# EAGLE design 1_3_OLED_FOR_1U (EAGLE 9.2.0)
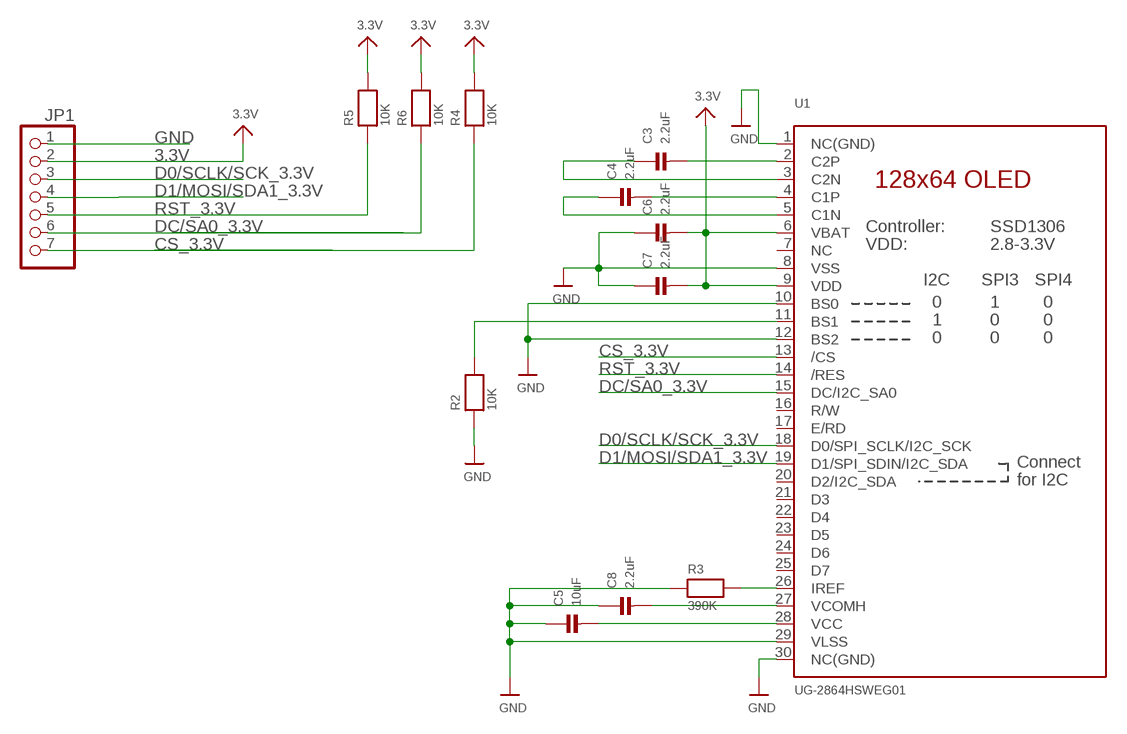
[diagram p0: schematic, sheet 1]

## Parts
C3  2.2uF  CAP_CERAMIC0603MINI  [0603-MINI]
C4  2.2uF  CAP_CERAMIC0603MINI  [0603-MINI]
C5  10uF  CAP_CERAMIC0603MINI  [0603-MINI]
C6  2.2uF  CAP_CERAMIC0603MINI  [0603-MINI]
C7  2.2uF  CAP_CERAMIC0603MINI  [0603-MINI]
C8  2.2uF  CAP_CERAMIC0603MINI  [0603-MINI]
JP1  HEADER-1X7ROUND  [1X07_ROUND]
R2  10K  RESISTOR0603MINI  [0603-MINI]
R3  390K  RESISTOR0603MINI  [0603-MINI]
R4  10K  RESISTOR0603MINI  [0603-MINI]
R5  10K  RESISTOR0603MINI  [0603-MINI]
R6  10K  RESISTOR0603MINI  [0603-MINI]
U1  UG-2864HSWEG01  DISP_OLED_UG-2864HSWEG01  [UG-2864HSWEG01_1.3_WRAPAROUND]

## Nets
3.3V: C6.2 C7.2 JP1.2 R4.2 R5.2 R6.2 U1.6(VBAT) U1.9(VDD)
CS_3.3V: JP1.7 R4.1 U1.13(/CS)
D0/SCLK/SCK_3.3V: JP1.3 U1.18(D0/SPI_SCLK/I2C_SCK)
D1/MOSI/SDA1_3.3V: JP1.4 U1.19(D1/SPI_SDIN/I2C_SDA)
DC/SA0_3.3V: JP1.6 R6.1 U1.15(DC/I2C_SA0)
GND: C5.1 C6.1 C7.1 C8.1 JP1.1 R2.1 R3.1 U1.1(NC(GND)) U1.8(VSS) U1.10(BS0) U1.12(BS2) U1.29(VLSS) U1.30(NC(GND))
N$1: R2.2 U1.11(BS1)
N$3: R3.2 U1.26(IREF)
N$4: C3.2 U1.2(C2P)
N$5: C3.1 U1.3(C2N)
N$6: C4.2 U1.4(C1P)
N$7: C4.1 U1.5(C1N)
N$11: C5.2 U1.28(VCC)
N$12: C8.2 U1.27(VCOMH)
RST_3.3V: JP1.5 R5.1 U1.14(/RES)
Unconnected: U1.7(NC) U1.16(R/W) U1.17(E/RD) U1.20(D2/I2C_SDA) U1.21(D3) U1.22(D4) U1.23(D5) U1.24(D6) U1.25(D7)

## Library data of the parts
C3-C8 = microbuilder:CAP_CERAMIC: Ceramic Capacitors 0402 - 0402 Surface Mount Capacitors 16pF 50V 5% [Digikey: 445-4899-2-ND] 18pF 50V 5% [Digikey: 490-1281-2-ND] 22pF 50V 5% [Digikey: 490-1283-2-ND] 68pF 50V 5% [Digikey: 490-1289-2-ND] 0.1uF 10V 10% [Digikey: 490-1318-2-ND] 1.0uF 6.3V 10% [Digikey: 490-1320-2-ND] 0603 - 0603 Surface Mount Capacitors 16 pF 50V 5% [Digikey: 445-5051-2-ND] 22 pF 50V [Digikey: PCC220ACVTR-ND] 33 pF 50V 5% [Digikey: 490-1415-1-ND] 56pF 50V 5% [Digikey: 490-1421-1-ND] 220pF 50V 5% [Digikey: 445-1285-1-ND] 680 pF 50V 2200 pF 50V 5% C0G [Digikey: 445-1297-1-ND] 5600 pF 100V 5% X7R [Digikey: 478-3711-1-ND] 0.1 µF 25V 10% [Digikey: PCC2277TR-ND] 0.22 µF 16V 10% X7R [Digikey: 445-1318-1-ND] 1.0 µF 25V 10% [Digikey: 445-5146-2-ND] 0603 - RF Specific 3pF 250V +/-0.1pF RF [Digikey: 712-1347-1-ND] 18 pF 250V 5% [Digikey: 478-3505-1-ND or 712-1322-1-ND] 56 pF 250V 5% C0G RF [Digikey: 490-4867-1-ND] 68 pF 250V RF [Digikey: 490-4868-1-ND] 0805 - 0805 Surface Mount Capacitors 220 pF 250V 2% RF Ceramic Capacitor [Digikey: 712-1398-1-ND] 1000 pF 50V 2% NP0 Ceramic Capacitor [Digikey: 478-3760-1-ND] 0.1 µF 25V 10% Ceramic Capacitor [Digikey: PCC1828TR-ND] 1.0 µF 16V 10% Ceramic Capacitor[Digikey: 490-1691-2-ND] 10.0 µF 10V 10% Ceramic Capacitor[Digikey: 709-1228-1-ND] 10.0 uF 16V 10% Ceramic Capacitor [Digikey: 478-5165-2-ND] 47 uF 6.3V 20% Ceramic Capacitor [Digikey: 587-1779-1-ND or 399-5506-1-ND] 1206 - 1206 Surface Mount Capacitors 47uF 10V 20% Ceramic Capacitor [Digikey: 490-5528-1-ND or 399-5508-1-ND or 445-6010-1-ND] 100uF 6.3V -20%, +80% Y5V Ceramic Capacitor (Digikey: 490-4512-1-ND, Mouser: 81-GRM31CF50J107ZE1L)
JP1 = microbuilder:HEADER-1X7: PIN HEADER; SPICEPREFIX: X
R2-R6 = microbuilder:RESISTOR: Resistors 0402 - 0402 Surface Mount Package 22 Ohm 1% 1/16W [Digikey: 311-22.0LRTR-ND] 33 Ohm 5% 1/16W 1.0K 5% 1/16W 1.5K 5% 1/16W 2.0K 1% 1/16W 10.0K 1% 1/16W [Digikey: 311-10.0KLRTR-ND] 10.0K 5% 1/16W [Digikey: RMCF0402JT10K0TR-ND] 12.1K 1% 1/16W [Digikey: 311-22.0LRTR-ND] 100.0K 5% 1/16W 0603 - 0603 Surface Mount Package 0 Ohm 1/10 Watt 1% Resistor 15 Ohm 1/10 Watt 1% Resistor 33 Ohm 1/10 Watt 1% Resistor 49.9 Ohm 1/10 Watt 1% Resistor 100 Ohm 1/10 Watt 1% Resistor 150 Ohm 1/10 Watt 1% Resistor 240 Ohm 1/10 Watt 1% Resistor 390 Ohm 1/10 Watt 1% Resistor 560 Ohm 1/10 Watt 1% Resistor 680 Ohm 1/10 Watt 1% Resistor 750 Ohm 1/10 Watt 1% Resistor 1.0K Ohm 1/10 Watt 1% Resistor 1.5K Ohm 1/10 Watt 1% Resistor 2.0K Ohm 1/10 Watt 1% Resistor 2.2K Ohm 1/10 Watt 1% Resistor 3.3K Ohm 1/10 Watt 1% Resistor 4.7K Ohm 1/10 Watt 1% Resistor 10.0K Ohm 1/10 Watt 1% Resistor 12.0K Ohm 1/10 Watt 1% Resistor 12.1K Ohm 1/10 Watt 1% Resistor 20.0K Ohm 1/10 Watt 1% Resistor 33.0K Ohm 1/10 Watt 1% Resistor 100.0K Ohm 1/10 Watt 1% Resistor 0805 - 0805 Surface Mount Package 0 Ohm 1/8 Watt 1% Resistor 33 Ohm 1/8 Watt 1% Resistor 100 Ohm 1/8 Watt 1% Resistor 150 Ohm 1/8 Watt 1% Resistor 200 Ohm 1/8 Watt 1% Resistor 240 Ohm 1/8 Watt 1% Resistor 330 Ohm 1/8 Watt 1% Resistor 390 Ohm 1/8 Watt 1% Resistor 470 Ohm 1/8 Watt 1% Resistor 1.0K Ohm 1/8 Watt 1% Resistor 1.5K Ohm 1/8 Watt 1% Resistor 2.0K Ohm 1/8 Watt 1% Resistor 4.7K Ohm 1/8 Watt 1% Resistor 5.1K Ohm 1/8 Watt 1% Resistor 5.6K Ohm 1/8 Watt 1% Resistor 10.0K Ohm 1/8 Watt 1% Resistor 22.0K Ohm 1/8 Watt 1% Resistor 33.0K Ohm 1/8 Watt 1% Resistor 100K Ohm 1/8 Watt 1% Resistor 1206 - 1206 Surface Mount Package 2012 - 2010 Surface Mount Package 0.11 Ohm 1/2 Watt 1% Resistor - Digikey: RHM.11UCT-ND
U1 = microbuilder:DISP_OLED_UG-2864HSWEG01: UG-2864HSWEG01 OLED display Both 1.3" and 0.96" models share the same FPC tab footprint, only the screen dimensions vary.

## Board
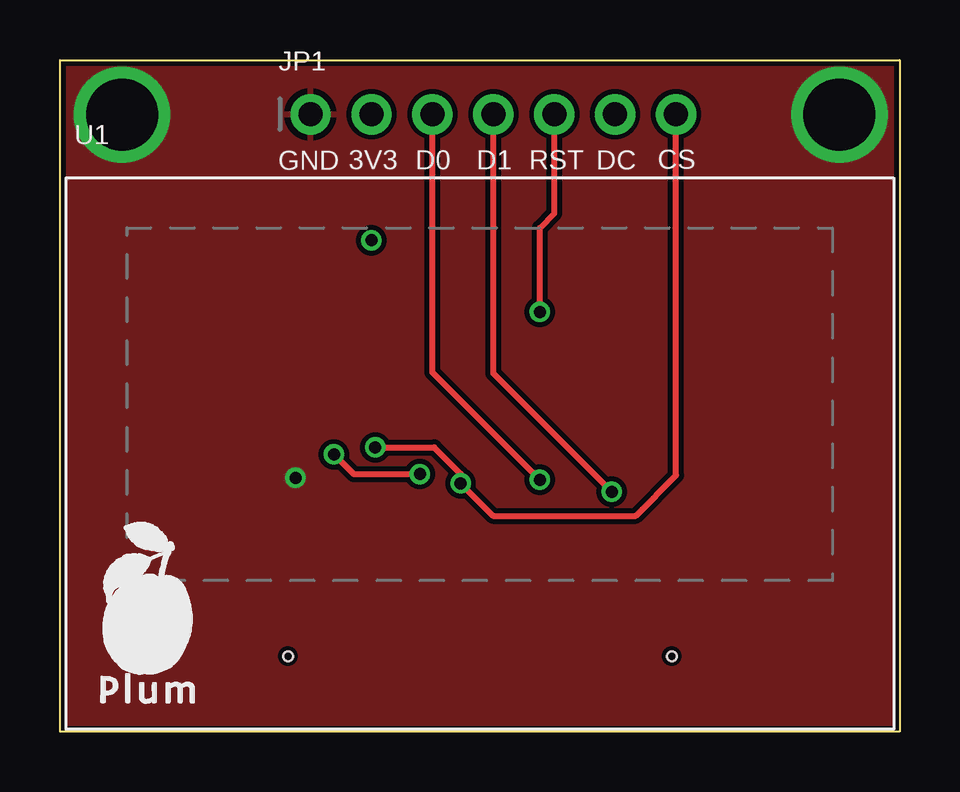
[diagram p1: board, top side]
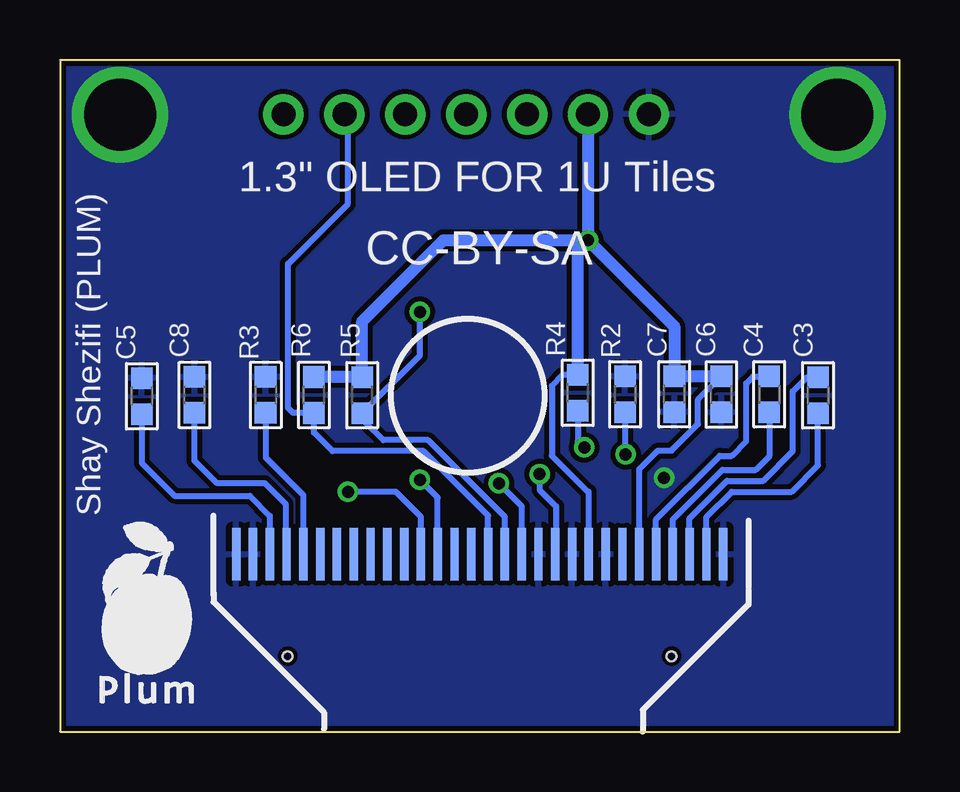
[diagram p2: board, bottom side, seen from below]

Size 35 x 28 mm. Coordinates in mm from the lower left corner, seen from the top.
Outline: 0,0 0,28 35,28 35,0 0,0
Copper layers (1*16): Top 0.0356mm / dielectric 1.5011mm / Bottom 0.0356mm
Design rules "LaenPCBOrder *": minimum track width 6mil, minimum drill 13mil, track to track 8mil, track to pad 8mil, pad to pad 8mil, via to via 8mil, smd to smd 8mil, copper to edge 8mil, drill to drill 8mil, minimum pad ring 7mil, minimum via ring 7mil, stop-mask expansion 3mil, vias tented up to drill 20mil, thermal gap 10mil

### Footprints (pad centres in the part's own frame; a part is rotated, then mirrored left to right if it is on the bottom)
0603-MINI = smd 0.9 x 0.9: 1 -0.75,0; 2 0.75,0
1X07_ROUND = drill 1 pad 1.676: 1 -7.62,0; 2 -5.08,0; 3 -2.54,0; 4 0,0; 5 2.54,0; 6 5.08,0; 7 7.62,0
UG-2864HSWEG01_1.3_WRAPAROUND = smd 0.35 x 2.2 bottom: 1 -10.15,-0.2; 2 -9.45,-0.2; 3 -8.75,-0.2; 4 -8.05,-0.2; 5 -7.35,-0.2; 6 -6.65,-0.2; 7 -5.95,-0.2; 8 -5.25,-0.2; 9 -4.55,-0.2; 10 -3.85,-0.2; 11 -3.15,-0.2; 12 -2.45,-0.2; 13 -1.75,-0.2; 14 -1.05,-0.2; 15 -0.35,-0.2; 16 0.35,-0.2; 17 1.05,-0.2; 18 1.75,-0.2; 19 2.45,-0.2; 20 3.15,-0.2; 21 3.85,-0.2; 22 4.55,-0.2; 23 5.25,-0.2; 24 5.95,-0.2; 25 6.65,-0.2; 26 7.35,-0.2; 27 8.05,-0.2; 28 8.75,-0.2; 29 9.45,-0.2; 30 10.15,-0.2 | hole 0.4: -8,-4.45; 8,-4.45

### Placement (x,y rotation side)
C3  3.4,14.02 270 bottom
C4  5.43,14.06 270 bottom
C5  31.59,13.98 270 bottom
C6  7.43,14.06 90 bottom
C7  9.39,14.07 90 bottom
C8  29.4,14.04 270 bottom
JP1  18.07,25.73 0 top
R2  11.44,14.06 270 bottom
R3  26.43,14.04 270 bottom
R4  13.41,14.12 90 bottom
R5  22.4,14.03 90 bottom
R6  24.41,14.03 90 bottom
U1  17.5,7.59 0 top

### Tracks (layer width: path | path; a pad name or v marks a point on that pad's centre or on a via)
3.3V  (via drill 0.5)
  Bottom 0.254: C6.2 8.4,13.84 8.4,12.82 9.51,11.71 10.08,11.71 10.85,10.94 U1.6 | R4.2 14.04,14.87 14.5,14.41 14.5,11.5 13.01,10.01 12.96,10.01 12.96,7.4 U1.9
  Bottom 0.508: JP1.2 v12.98,20.48 | v12.98,20.48 9.39,16.89 C7.2 C6.2 | R4.2 13.41,20.06 v12.98,20.48 | v12.98,20.48 19.02,20.48 22.4,17.1 R5.2 R6.2 | v12.98,20.48
CS_3.3V  (via drill 0.5)
  Top 0.254: v13.14,11.85 15.6,11.85 16.7,10.74 v16.7,10.35 18.05,9 24,9 25.68,10.69 JP1.7
  Bottom 0.254: R4.1 13.41,12.11 v13.14,11.85 | v16.7,10.35 15.75,9.4 U1.13
D0/SCLK/SCK_3.3V  (via drill 0.5)
  Top 0.254: v20,10.5 15.53,14.97 JP1.3
  Bottom 0.254: U1.18 19.25,9.75 v20,10.5
D1/MOSI/SDA1_3.3V  (via drill 0.5)
  Top 0.254: v23,10 18.07,14.94 JP1.4
  Bottom 0.254: U1.19 19.95,8.95 21,10 v23,10
DC/SA0_3.3V
  Bottom 0.254: U1.15 17.15,9 19.84,11.69 23.64,11.69 24.41,12.46 R6.1 25.28,13.28 25.5,13.5 25.5,19.5 23,22 23,25.59 JP1.6
GND  (via drill 0.5, 3)
  other vias: 9.81,10.58 2.59,25.72 32.5,25.72
  pour Top: 0,0 0,28 35,28 35,0
  pour Bottom: 0,0 0,28 35,28 35,0
N$1  (via drill 0.5)
  Top 0.254: v11.42,11.56 12.24,10.74 v15.01,10.74
  Bottom 0.254: R2.2 11.44,11.57 v11.42,11.56 | v15.01,10.74 15.01,10.08 14.31,9.39 14.31,7.43 U1.11
N$3
  Bottom 0.254: U1.26 24.86,9.86 26.43,11.43 R3.2
N$4
  Bottom 0.254: U1.2 8.05,8.95 7,10 4.5,10 3.4,11.1 C3.2
N$5
  Bottom 0.254: C3.1 3.86,14.77 4.45,14.18 4.45,11.69 5.69,10.46 7.19,10.46 8.75,8.89 U1.3
N$6
  Bottom 0.254: U1.4 9.45,8.84 7.38,10.91 6,10.91 5.41,11.5 5.41,13.29 C4.2
N$7
  Bottom 0.254: U1.5 10.15,8.85 7.5,11.5 7,11.5 6.39,12.11 6.39,14.51 6.1,14.81 C4.1
N$11
  Bottom 0.254: U1.28 26.25,9 27.07,9.82 30.23,9.82 31.59,11.19 C5.2
N$12
  Bottom 0.254: U1.27 25.57,7.42 25.57,9.47 26.45,10.35 28.45,10.35 29.4,11.3 29.39,11.3 C8.2
RST_3.3V  (via drill 0.5)
  Top 0.254: v20,17.5 20,21 20.61,21.61 JP1.5
  Bottom 0.254: U1.14 16.45,8.95 19.65,12.15 21.51,12.15 22.27,12.91 22.27,13.28 R5.1 20,15.68 v20,17.5 20,16

### Text on the board
tPlace: GND | 3V3 | D0 | D1 | RST | DC | CS
bPlace: 1.3" OLED FOR 1U Tiles | CC-BY-SA | Shay Shezifi (PLUM)